# Altium schematic sheet RK3566_OSC_PLL_PMUO1_2.SchDoc
size A3; SheetNumber: 20; SheetTotal: 20
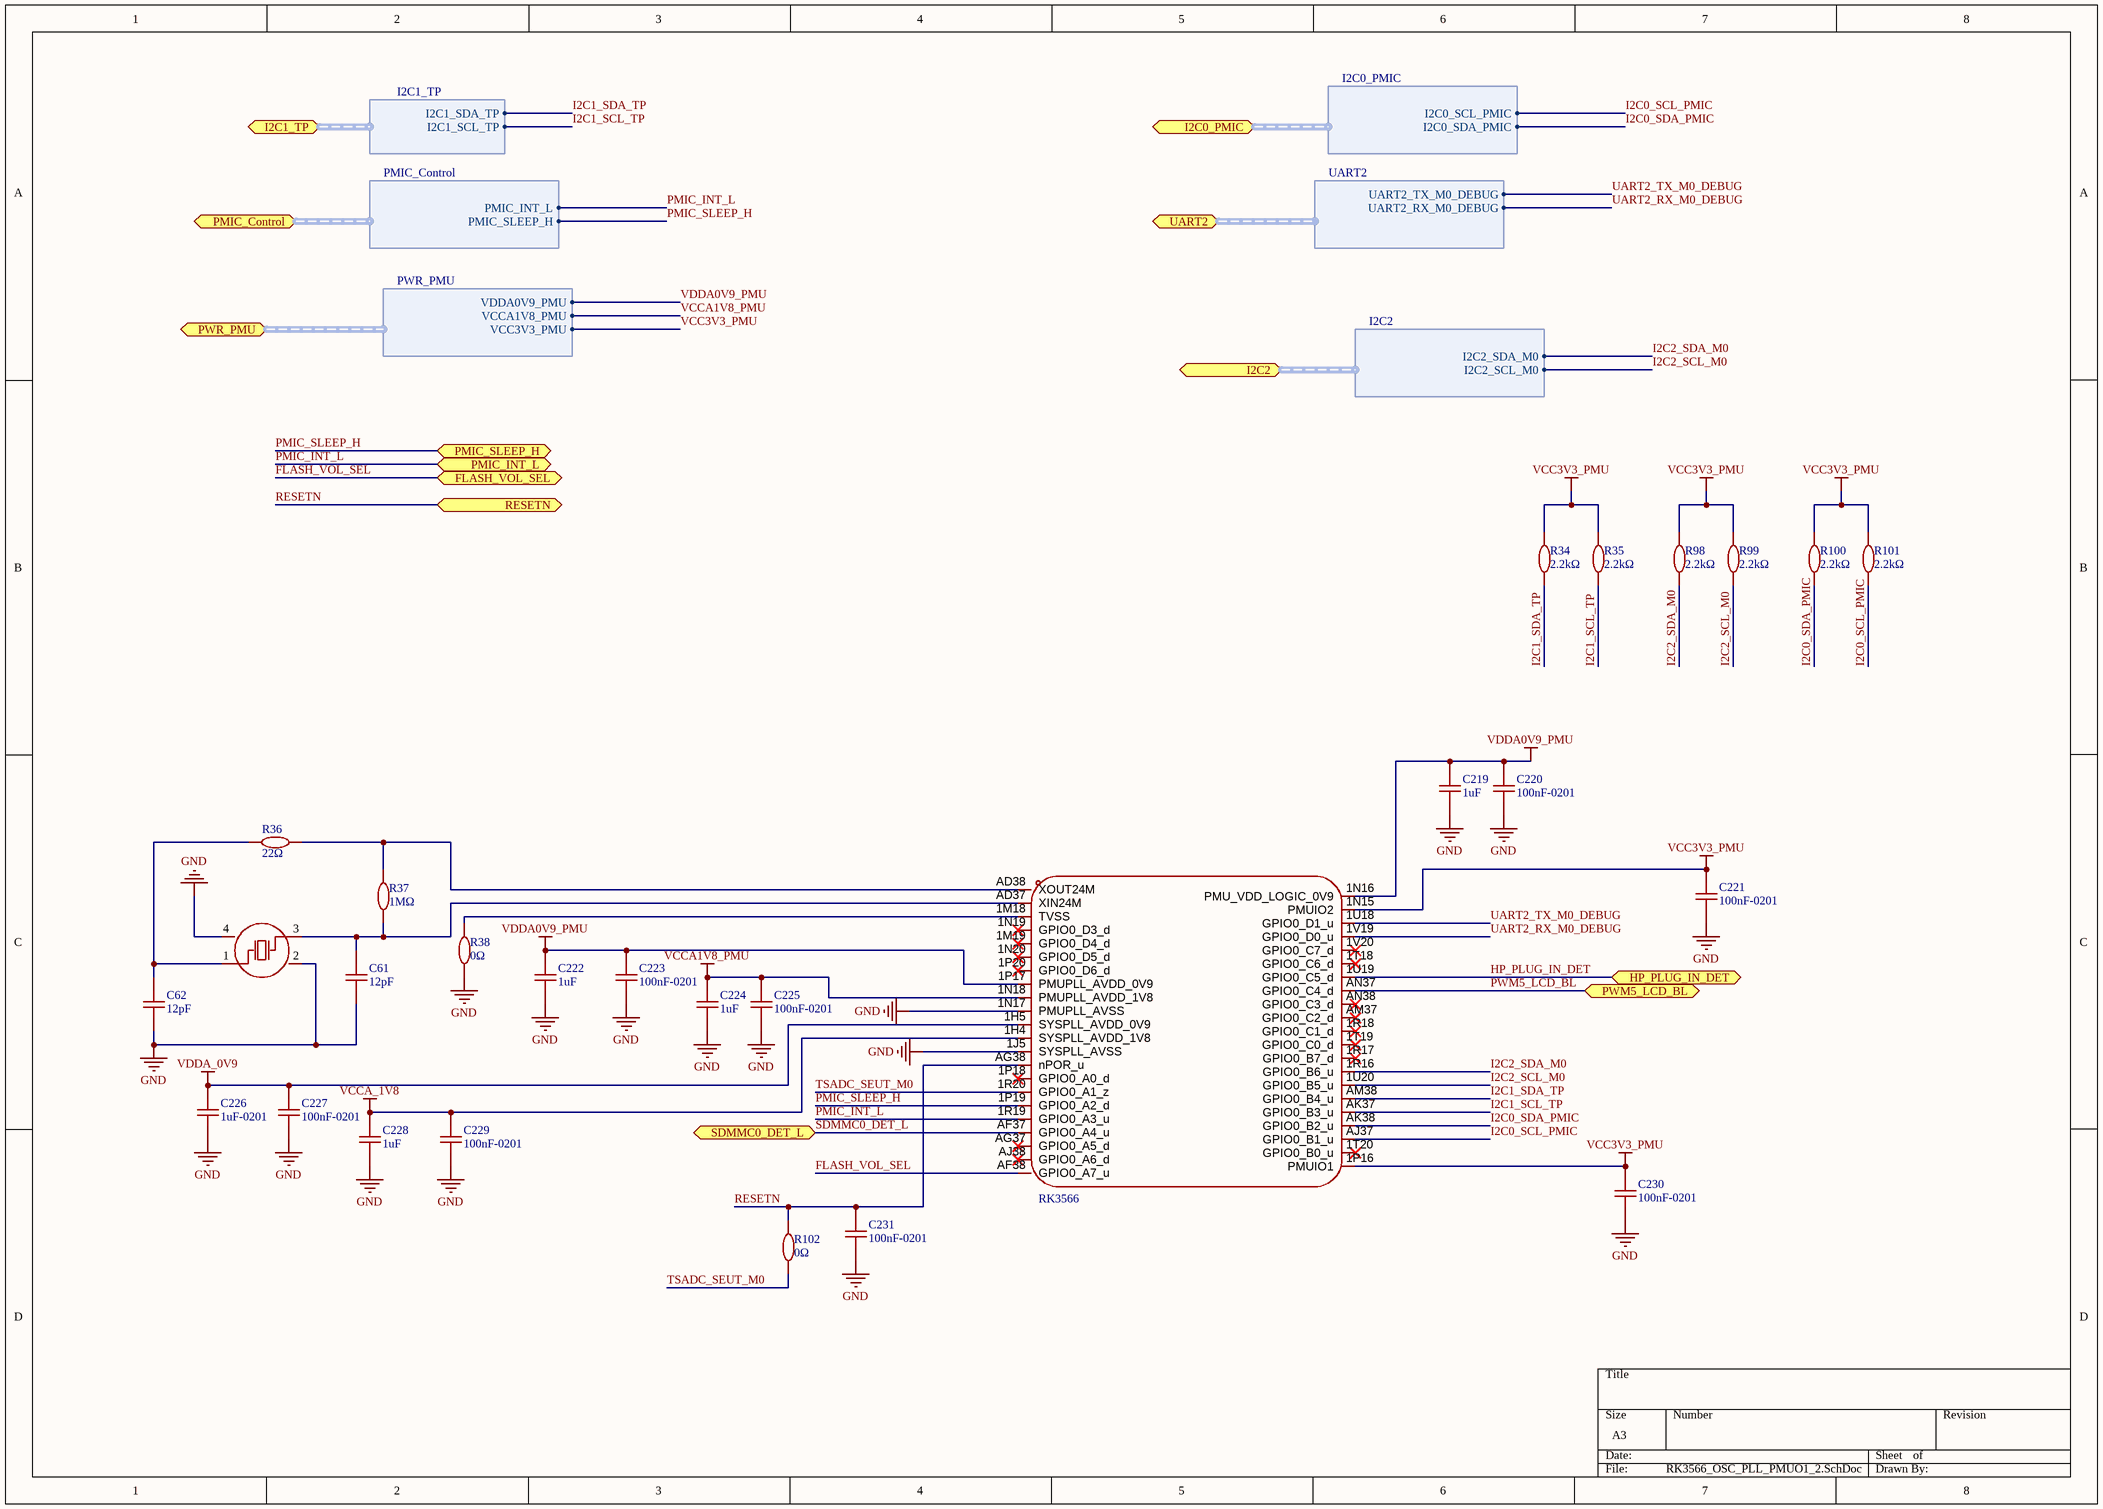
[diagram p0: RK3566_OSC_PLL_PMUO1_2.SchDoc]

## Parts
C61  12pF  [C0402]
C62  12pF  [C0402]
C219  1uF  [C0402]
C220  100nF-0201  [C0201]
C221  100nF-0201  [C0201]
C222  1uF  [C0402]
C223  100nF-0201  [C0201]
C224  1uF  [C0402]
C225  100nF-0201  [C0201]
C226  1uF-0201  [C0201]
C227  100nF-0201  [C0201]
C228  1uF  [C0402]
C229  100nF-0201  [C0201]
C230  100nF-0201  [C0201]
C231  100nF-0201  [C0201]
R34  2.2kΩ  [R0402]
R35  2.2kΩ  [R0402]
R36  22Ω  [R0402]
R37  1MΩ  [R0402]
R38  0Ω  [R0402]
R98  2.2kΩ  [R0402]
R99  2.2kΩ  [R0402]
R100  2.2kΩ  [R0402]
R101  2.2kΩ  [R0402]
R102  0Ω  [R0402]
U2  RK3566  [BGA-565_L15.5-W14.4-P0.40_RK3566_1]  (part D of 8)
X2  24MHz  [CRYSTAL-SMD_4P-L3.2-W2.5-BL]  (value not drawn)

## Ports
FLASH_VOL_SEL (bidir, see RK3566[1D], POWER[6D], POWER_FLASH_POWER_MANAGE[3A], RK3566[3D]), HP_PLUG_IN_DET (bidir, see RK3566[2C], Audio_AND_HPJ[4C], RK3566[3C]), I2C0_PMIC (bidir, harness I2C0_PMIC, see RK3566[2D], POWER[4D], POWER_EXTENSION[4A], POWER_PMIC[1A], RK3566[3D]), I2C1_TP (bidir, harness I2C1_TP, see RK3566[2C], MIPI_DSI_TP[3D], RK3566[3C]), I2C2 (bidir, harness I2C2, see RK3566[2C], DEBUG_AND_GPIO[6B], RK3566[3C]), PMIC_Control (bidir, harness PMIC_Control, see RK3566[2D], POWER[3D], POWER_PMIC[4A], RK3566[3D]), PMIC_INT_L (bidir, see RK3566[1D], POWER[3D], POWER_PMIC[7A], RK3566[3D]), PMIC_SLEEP_H (bidir, see RK3566[1D], POWER[4D], POWER_EXTENSION[1A], POWER_PMIC[7A], RK3566[3D]), PWM5_LCD_BL (bidir, see RK3566[2D], MIPI_DSI_TP[1B], RK3566[3D]), PWR_PMU (bidir, harness PWR_PMU, see RK3566[2C], LPDDR4[4C], POWER[2D], POWER_PMIC[4D], RK3566[3C]), RESETN (bidir, see RK3566[2C], DEBUG_AND_GPIO[8D], POWER[1C], POWER_PMIC[7A], RK3566[3C]), SDMMC0_DET_L (bidir, see RK3566[2C], EMMC_SD[8C], RK3566[3C]), UART2 (bidir, harness UART2, see RK3566[2D], DEBUG_AND_GPIO[1B], RK3566[3D])

## Harnesses
I2C1_TP: I2C1_SDA_TP, I2C1_SCL_TP
PMIC_Control: PMIC_INT_L, PMIC_SLEEP_H
I2C0_PMIC: I2C0_SCL_PMIC, I2C0_SDA_PMIC
UART2: UART2_RX_M0_DEBUG, UART2_TX_M0_DEBUG
PWR_PMU: VCCA1V8_PMU, VDDA0V9_PMU, VCC3V3_PMU
I2C2: I2C2_SDA_M0, I2C2_SCL_M0

## Nets
GND: C61.1 C62.1 C219.1 C220.1 C221.1 C222.1 C223.1 C224.1 C225.1 C226.1 C227.1 C228.1 C229.1 C230.1 C231.1 R38.1 U2.1J5(SYSPLL_AVSS) U2.1N17(PMUPLL_AVSS) X2.2(GND) X2.4(GND)
VCC3V3_PMU: C221.2 C230.2 R34.2 R35.2 R98.2 R99.2 R100.2 R101.2 U2.1N15(PMUIO2) U2.1P16(PMUIO1) ; port PWR_PMU.VCC3V3_PMU
VCCA1V8_PMU: C224.2 C225.2 U2.1N18(PMUPLL_AVDD_1V8) ; port PWR_PMU.VCCA1V8_PMU
VCCA_1V8: C228.2 C229.2 U2.1H4(SYSPLL_AVDD_1V8)
VDDA0V9_PMU: C219.2 C220.2 C222.2 C223.2 U2.1N16(PMU_VDD_LOGIC_0V9) U2.1P17(PMUPLL_AVDD_0V9) ; port PWR_PMU.VDDA0V9_PMU
VDDA_0V9: C226.2 C227.2 U2.1H5(SYSPLL_AVDD_0V9)
FLASH_VOL_SEL: U2.AF38(GPIO0_A7_u) ; port FLASH_VOL_SEL
HP_PLUG_IN_DET: U2.1U19(GPIO0_C5_d) ; port HP_PLUG_IN_DET
I2C0_SCL_PMIC: R101.1 U2.AJ37(GPIO0_B1_u) ; port I2C0_PMIC.I2C0_SCL_PMIC
I2C0_SDA_PMIC: R100.1 U2.AK38(GPIO0_B2_u) ; port I2C0_PMIC.I2C0_SDA_PMIC
I2C1_SCL_TP: R35.1 U2.AK37(GPIO0_B3_u) ; port I2C1_TP.I2C1_SCL_TP
I2C1_SDA_TP: R34.1 U2.AM38(GPIO0_B4_u) ; port I2C1_TP.I2C1_SDA_TP
I2C2_SCL_M0: R99.1 U2.1U20(GPIO0_B5_u) ; port I2C2.I2C2_SCL_M0
I2C2_SDA_M0: R98.1 U2.1R16(GPIO0_B6_u) ; port I2C2.I2C2_SDA_M0
PMIC_INT_L: U2.1R19(GPIO0_A3_u) ; port PMIC_INT_L, port PMIC_Control.PMIC_INT_L
PMIC_SLEEP_H: U2.1P19(GPIO0_A2_d) ; port PMIC_SLEEP_H, port PMIC_Control.PMIC_SLEEP_H
PWM5_LCD_BL: U2.AN37(GPIO0_C4_d) ; port PWM5_LCD_BL
RESETN: C231.2 R102.2 U2.AG38(nPOR_u) ; port RESETN
SDMMC0_DET_L: U2.AF37(GPIO0_A4_u) ; port SDMMC0_DET_L
TSADC_SEUT_M0: R102.1 U2.1R20(GPIO0_A1_z)
UART2_RX_M0_DEBUG: U2.1V19(GPIO0_D0_u) ; port UART2.UART2_RX_M0_DEBUG
UART2_TX_M0_DEBUG: U2.1U18(GPIO0_D1_u) ; port UART2.UART2_TX_M0_DEBUG
NetC61_2: C61.2 R37.1 U2.AD37(XIN24M) X2.3(OSC2)
NetC62_2: C62.2 R36.1 X2.1(OSC1)
NetR36_2: R36.2 R37.2 U2.AD38(XOUT24M)
NetR38_2: R38.2 U2.1M18(TVSS)

Not connected (* = marked no-connect by the designer): U2 1M19(GPIO0_D4_d)* 1N19(GPIO0_D3_d)* 1N20(GPIO0_D5_d)* 1P18(GPIO0_A0_d)* 1P20(GPIO0_D6_d)* 1R17(GPIO0_B7_d)* 1R18(GPIO0_C1_d)* 1T18(GPIO0_C6_d)* 1T19(GPIO0_C0_d)* 1T20(GPIO0_B0_u)* 1V20(GPIO0_C7_d)* AG37(GPIO0_A5_d)* AJ38(GPIO0_A6_d)* AM37(GPIO0_C2_d)* AN38(GPIO0_C3_d)*

## Library data of the parts
C61 C62 = 12pF: 50V 12pF C0G ±5% 0402 Ceramic Capacitors ROHS
C219 C222 C224 C228 = 1uF: 50V 1uF X5R ±10% 0402 Ceramic Capacitors ROHS
C220 C221 C223 C225 C227 C229-C231 = 100nF-0201: CL03A104KO3NNNC
C226 = 1uF-0201: CL03A104KO3NNNC
R34 R35 R98-R101 = 2.2kΩ: 2.2kΩ ±1% 62.5mW 厚膜电阻
R36 = 22Ω: 小尺寸、重量轻。降低组装成本,与贴片机匹配。适用于波峰焊和回流焊
R37 = 1MΩ: 62.5mW 1MΩ 50V ±100ppm/℃ Thick Film Resistor ±1% 0402 Chip Resistor - Surface Mount ROHS
R38 = 0Ω-0201: 小尺寸、重量轻。降低组装成本,与贴片机匹配。适用于波峰焊和回流焊
R102 = 0Ω: 0Ω 62.5mW 50V Thick Film Resistor ±1% 0402 Chip Resistor - Surface Mount ROHS
U2 = RK3566: BGA-565(15.5x14.4); Symbol: RK3566
X2 = X322524MOB4SI: Crystal Oscillator 12pF SMD3225-4P Crystals ROHS; Manufacturer: YXC(扬兴晶振); Add into BOM: yes; Normal temperature Frequency Tolerance: ±10ppm; Frequency Stability: ±20ppm; Symbol: X322524MOB4SI; Device: X322524MOB4SI; LCSC Part Name: YSX321SL 24MHZ 4P 3225 12PF ±10PPM -40~85℃ (±20PPM); Supplier Part: C70590; Manufacturer Part: X322524MOB4SI; Supplier Footprint: SMD3225-4P; JLCPCB Part Class: Extended Part; Datasheet: https://item.szlcsc.com/datasheet/X322524MOB4SI/71688.html; Supplier: LCSC; Convert to PCB: yes; Type: Surface Mount Crystal; Value: 24MHz; Load Capacitance: 12pF; Operating Temperature: -40℃~+85℃